# EAGLE design powerboard (EAGLE 8.0.2)
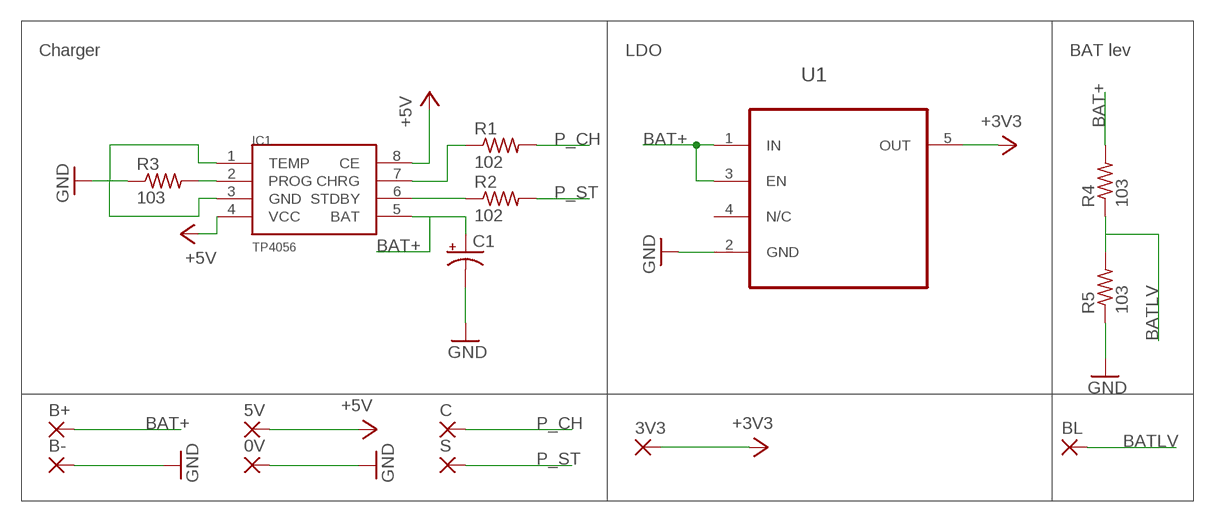
[diagram p0: schematic, sheet 1]

## Parts
0V  SMD5  [SMD2,54-5,08]
3V3  SMD5  [SMD2,54-5,08]
5V  SMD5  [SMD2,54-5,08]
B+  SMD5  [SMD2,54-5,08]
B-  SMD5  [SMD2,54-5,08]
BL  SMD5  [SMD2,54-5,08]
C  SMD5  [SMD2,54-5,08]
C1  CPOL-USR/2012-12R  [R/2012-12R]
IC1  TP4056  [SOP-8]
R1  102  R-US_M2012  [M2012]
R2  102  R-US_M2012  [M2012]
R3  103  R-US_M2012  [M2012]
R4  103  R-US_M2012  [M2012]
R5  103  R-US_M2012  [M2012]
S  SMD5  [SMD2,54-5,08]
U1  TLV70033DDCT  [SOT95P280X110-5N]

## Nets
+3V3: 3V3.1(P) U1.5(OUT)
+5V: 5V.1(P) IC1.4(VCC) IC1.8(CE)
BAT+: B+.1(P) C1.+ IC1.5(BAT) R4.2 U1.1(IN) U1.3(EN)
BATLV: BL.1(P) R4.1 R5.2
GND: 0V.1(P) B-.1(P) C1.- IC1.1(TEMP) IC1.3(GND) R3.1 R5.1 U1.2(GND)
N$1: IC1.7(CHRG) R1.1
N$2: IC1.6(STDBY) R2.1
N$3: IC1.2(PROG) R3.2
P_CH: C.1(P) R1.2
P_ST: R2.2 S.1(P)
Unconnected: U1.4(N/C)

## Notes on the sheet
- Charger | LDO | BAT lev

## Library data of the parts
0V 3V3 5V B+ B- BL C S = wirepad:SMD5: SMD PAD
C1 = rcl:CPOL-US: POLARIZED CAPACITOR, American symbol
IC1 = tp4056:TP4056
R1-R5 = rcl:R-US_: RESISTOR, American symbol
U1 = Texas Instruments_By_element14_Batch_1:TLV70033DDCT: 200-mA, Low-IQ, Low-Dropout Regulator for Portable Devices; MPN: TLV70033DDCT; OC_FARNELL: 1778230; OC_NEWARK: 50R4446; PACKAGE: TSOT-23-5; SUPPLIER: Texas Instruments

## Board
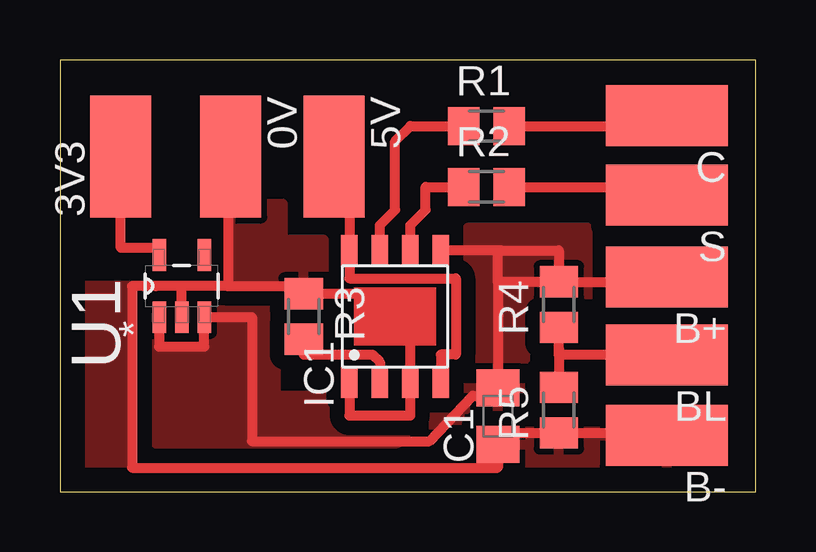
[diagram p1: board, top side]

Size 29 x 18 mm. Coordinates in mm from the lower left corner, seen from the top.
Outline: 0,0 29,0 29,18 0,18 0,0
Copper layers (1*16): Top 0.035mm / dielectric 1.5mm / Bottom 0.035mm
Design rules "default": minimum track width 10mil, minimum drill 24mil, track to track 8mil, track to pad 8mil, pad to pad 8mil, via to via 8mil, smd to smd 8mil, copper to edge 40mil, drill to drill 8mil, minimum pad ring 10mil, minimum via ring 8mil, stop-mask expansion 4mil, vias tented up to drill 0mil, thermal gap 10mil

### Footprints (pad centres in the part's own frame; a part is rotated, then mirrored left to right if it is on the bottom)
SMD2,54-5,08 = smd 2.54 x 5.08: 1 0,0
R/2012-12R = smd 1.55 x 1.8: + 1.175,0; - -1.175,0
SOP-8 = smd 1.3 x 0.7: 1 -2.75,1.905; 2 -2.75,0.635; 3 -2.75,-0.635; 4 -2.75,-1.905; 5 2.75,-1.905; 6 2.75,-0.635; 7 2.75,0.635; 8 2.75,1.905
M2012 = smd 1.3 x 1.6: 1 -0.95,0; 2 0.95,0
SOT95P280X110-5N = smd 1.321 x 0.559: 1 -1.295,0.94; 2 -1.295,0; 3 -1.295,-0.94; 4 1.295,-0.94; 5 1.295,0.94

### Placement (x,y rotation side)
0V  7.12,13.97 180 top
3V3  2.54,13.97 0 top
5V  11.43,13.97 180 top
B+  25.3,8.95 90 top
B-  25.3,2.34 90 top
BL  25.3,5.7 90 top
C  25.3,15.67 90 top
C1  18.25,3.15 90 top
IC1  13.97,7.3 90 top
R1  17.78,15.24 0 top
R2  17.78,12.7 0 top
R3  10.16,7.3 270 top
R4  20.8,7.8 90 top
R5  20.8,3.4 90 top
S  25.3,12.36 90 top
U1  5.08,8.57 90 top

### Tracks (layer width: path | path; a pad name or v marks a point on that pad's centre or on a via)
+3V3
  Top 0.406: U1.5 4.13,9.87 4.13,10.16 2.54,10.16 3V3.1
+5V
  Top 0.406: 5V.1 12.06,13.34 IC1.8 12.06,8.89 16.51,8.89 16.51,5.71 15.88,5.71 IC1.4
BAT+
  Top 0.406: U1.1 4.13,7.28 4.13,6.03 6.02,6.03 U1.3 8,7.28 8,2.1 15.4,2.1 17.2,4 17.93,4 C1.+ 18.25,8.75 | 18.4,10.05 IC1.5 | 18.4,10.05 20.8,10.05 R4.2 | R4.2 25.3,8.75 B+.1 | 18.25,8.75 18.25,9.91 18.4,10.05 | R4.2 18.25,8.75
  pour Top (isolate 0.61): 4,8 4,2 14,2 16,3 22,3 22,11 17,11 17,4 9,4 9,8
BATLV
  Top 0.406: 20.8,6 R5.2 | 20.8,6 R4.1 | BL.1 20.8,5.7 20.8,6
GND
  Top 0.406: U1.2 5.08,8.57 | 7,8.57 5.08,8.57 | 7,8.57 10.16,8.57 R3.1 14.61,8.25 IC1.3 14.61,3.17 12.06,3.17 IC1.1 | 5.08,8.57 4,8.57 3.49,8.57 3,8.57 3,1 18.25,1 C1.- 18.25,2.45 R5.1 25.3,2.45 B-.1 | 0V.1 7,13.97 7,8.57
  pour Top: 18,2.5 18,1 26,1 26,2.5
  pour Top: 3,0.8 1,0.8 1,8.6 3,8.6
  pour Top: 7,12 7,8.6 11,8.6 11,10.5 9.3,10.5 9.3,12
N$1
  Top 0.406: R1.1 14.61,15.24 13.97,14.61 13.97,11.75 13.34,11.11 IC1.7
N$2
  Top 0.406: R2.1 15.24,12.7 15.24,11.75 14.61,11.11 IC1.6
N$3
  Top 0.406: IC1.2 13.34,5.4 13.02,5.71 10.16,5.71 R3.2
P_CH
  Top 0.406: R1.2 25.3,15.24 C.1
P_ST
  Top 0.406: R2.2 25.3,12.7 S.1